# EAGLE schematic l298 (EAGLE 6.1)
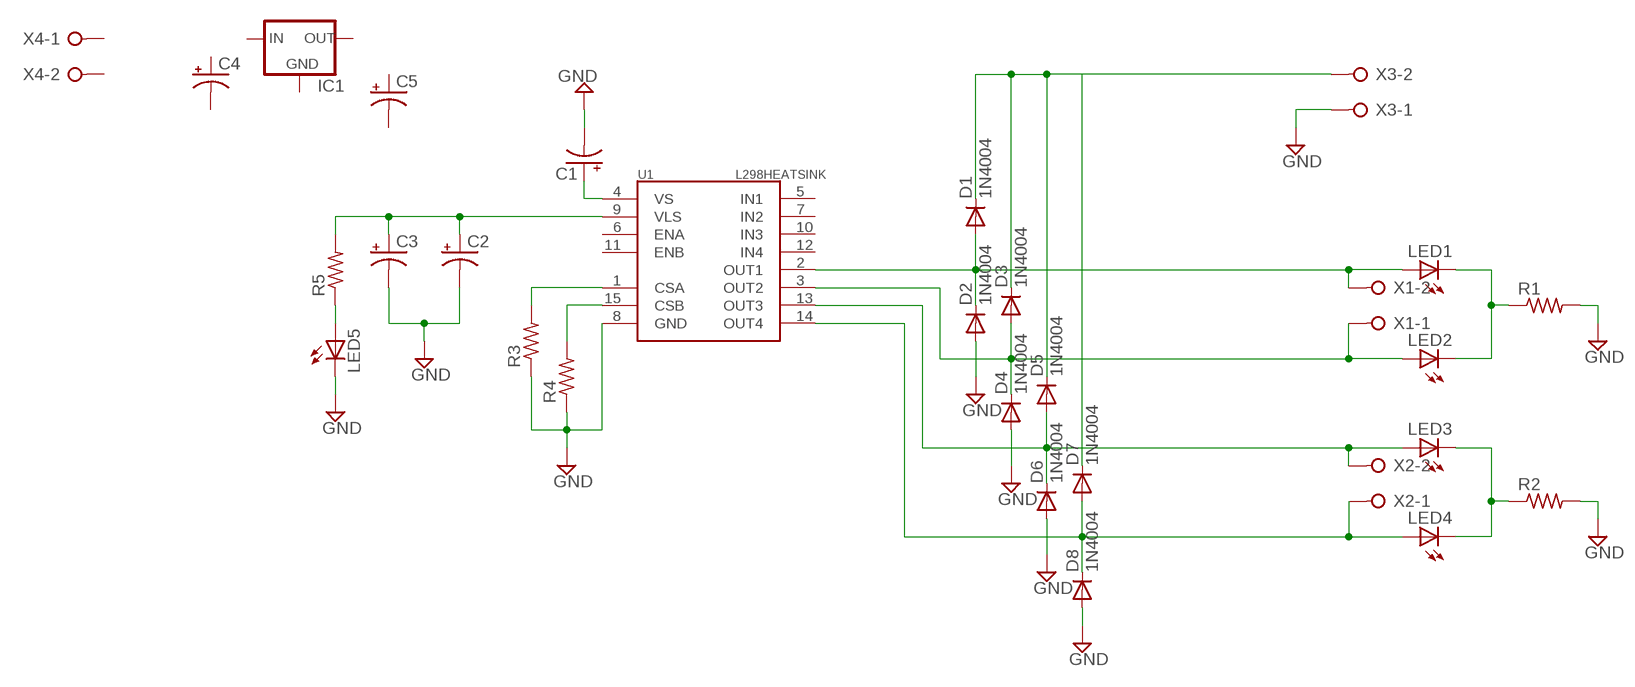
[diagram p0: schematic, sheet 1]

## Parts
C1  CPOL-USE3.5-8  [E3,5-8]
C2  CPOL-USE3.5-8  [E3,5-8]
C3  CPOL-USE3.5-8  [E3,5-8]
C4  CPOL-USE3.5-8  [E3,5-8]
C5  CPOL-USE3.5-8  [E3,5-8]
D1  1N4004  [DO41-10]
D2  1N4004  [DO41-10]
D3  1N4004  [DO41-10]
D4  1N4004  [DO41-10]
D5  1N4004  [DO41-10]
D6  1N4004  [DO41-10]
D7  1N4004  [DO41-10]
D8  1N4004  [DO41-10]
IC1  V_REG_78XXSIDE  [78XXL]
LED1  LED5MM  [LED5MM]
LED2  LED5MM  [LED5MM]
LED3  LED5MM  [LED5MM]
LED4  LED5MM  [LED5MM]
LED5  LED5MM  [LED5MM]
R1  R-US_0207/10  [0207/10]
R2  R-US_0207/10  [0207/10]
R3  R-US_0207/10  [0207/10]
R4  R-US_0207/10  [0207/10]
R5  R-US_0207/10  [0207/10]
U1  L298HEATSINK  [MULTIWATT15_6400BGHEATSINK]
X1  W237-2N  [W237-2N]
X2  W237-2N  [W237-2N]
X3  W237-2N  [W237-2N]
X4  W237-2N  [W237-2N]

## Nets
GND: C1.- C2.- C3.- D2.A D4.A D6.A D8.A LED5.K(C) R1.2 R2.2 R3.1 R4.1 U1.8(GND) X3.1
N$1: D1.A D2.C LED1.A U1.2(OUT1) X1.2
N$2: D3.A D4.C LED2.A U1.3(OUT2) X1.1
N$3: D5.A D6.C LED3.A U1.13(OUT3) X2.2
N$4: D7.A D8.C LED4.A U1.14(OUT4) X2.1
N$6: LED1.K(C) LED2.K(C) R1.1
N$7: LED3.K(C) LED4.K(C) R2.1
N$8: D1.C D3.C D5.C D7.C X3.2
N$11: R3.2 U1.1(CSA)
N$12: R4.2 U1.15(CSB)
N$14: C1.+ U1.4(VS)
N$15: LED5.A R5.1
N$17: C2.+ C3.+ R5.2 U1.9(VLS)
Unconnected: C4.+ C4.- C5.+ C5.- IC1.GND IC1.IN IC1.OUT U1.5(IN1) U1.6(ENA) U1.7(IN2) U1.10(IN3) U1.11(ENB) U1.12(IN4) X4.1 X4.2

## Library data of the parts
C1-C5 = rcl:CPOL-US: POLARIZED CAPACITOR, American symbol
D1-D8 = adafruit:1N4004: DIODE General purpose 1N400x type rectifier (With bigger pads) http://www.ladyada.net/library/pcb/eaglelibrary.html
IC1 = SparkFun:V_REG_78XX: Voltage Regulator Standard 7805 5V regulator. IGO (Input Ground Output). Spark Fun Electronics SKU : COM-00107
LED1-LED5 = adafruit:LED: LED OSRAM: - CHIPLED LG R971, LG N971, LY N971, LG Q971, LY Q971, LO R971, LY R971 LH N974, LH R974 LS Q976, LO Q976, LY Q976 LO Q996 - Hyper CHIPLED LW Q18S LB Q993, LB Q99A, LB R99A - SideLED LS A670, LO A670, LY A670, LG A670, LP A670 LB A673, LV A673, LT A673, LW A673 LH A674 LY A675 LS A676, LA A676, LO A676, LY A676, LW A676 LS A679, LY A679, LG A679 - Hyper Micro SIDELED® LS Y876, LA Y876, LO Y876, LY Y876 LT Y87S - SmartLED LW L88C, LW L88S LB L89C, LB L89S, LG L890 LS L89K, LO L89K, LY L89K LS L896, LA L896, LO L896, LY L896 - TOPLED LS T670, LO T670, LY T670, LG T670, LP T670 LSG T670, LSP T670, LSY T670, LOP T670, LYG T670 LG T671, LOG T671, LSG T671 LB T673, LV T673, LT T673, LW T673 LH T674 LS T676, LA T676, LO T676, LY T676, LB T676, LH T676, LSB T676, LW T676 LB T67C, LV T67C, LT T67C, LS T67K, LO T67K, LY T67K, LW E67C LS E67B, LA E67B, LO E67B, LY E67B, LB E67C, LV E67C, LT E67C LW T67C LS T679, LY T679, LG T679 LS T770, LO T770, LY T770, LG T770, LP T770 LB T773, LV T773, LT T773, LW T773 LH T774 LS E675, LA E675, LY E675, LS T675 LS T776, LA T776, LO T776, LY T776, LB T776 LHGB T686 LT T68C, LB T68C - Hyper Mini TOPLED® LB M676 - Mini TOPLED Santana® LG M470 LS M47K, LO M47K, LY M47K Source: http://www.osram.convergy.de/
R1-R5 = rcl:R-US_: RESISTOR, American symbol
U1 = SparkFun:L298: L298 Dual Full Bridge Driver
X1-X4 = con-wago-508:W237-2N: WAGO SREW CLAMP; OC_FARNELL: unknown; OC_NEWARK: unknown